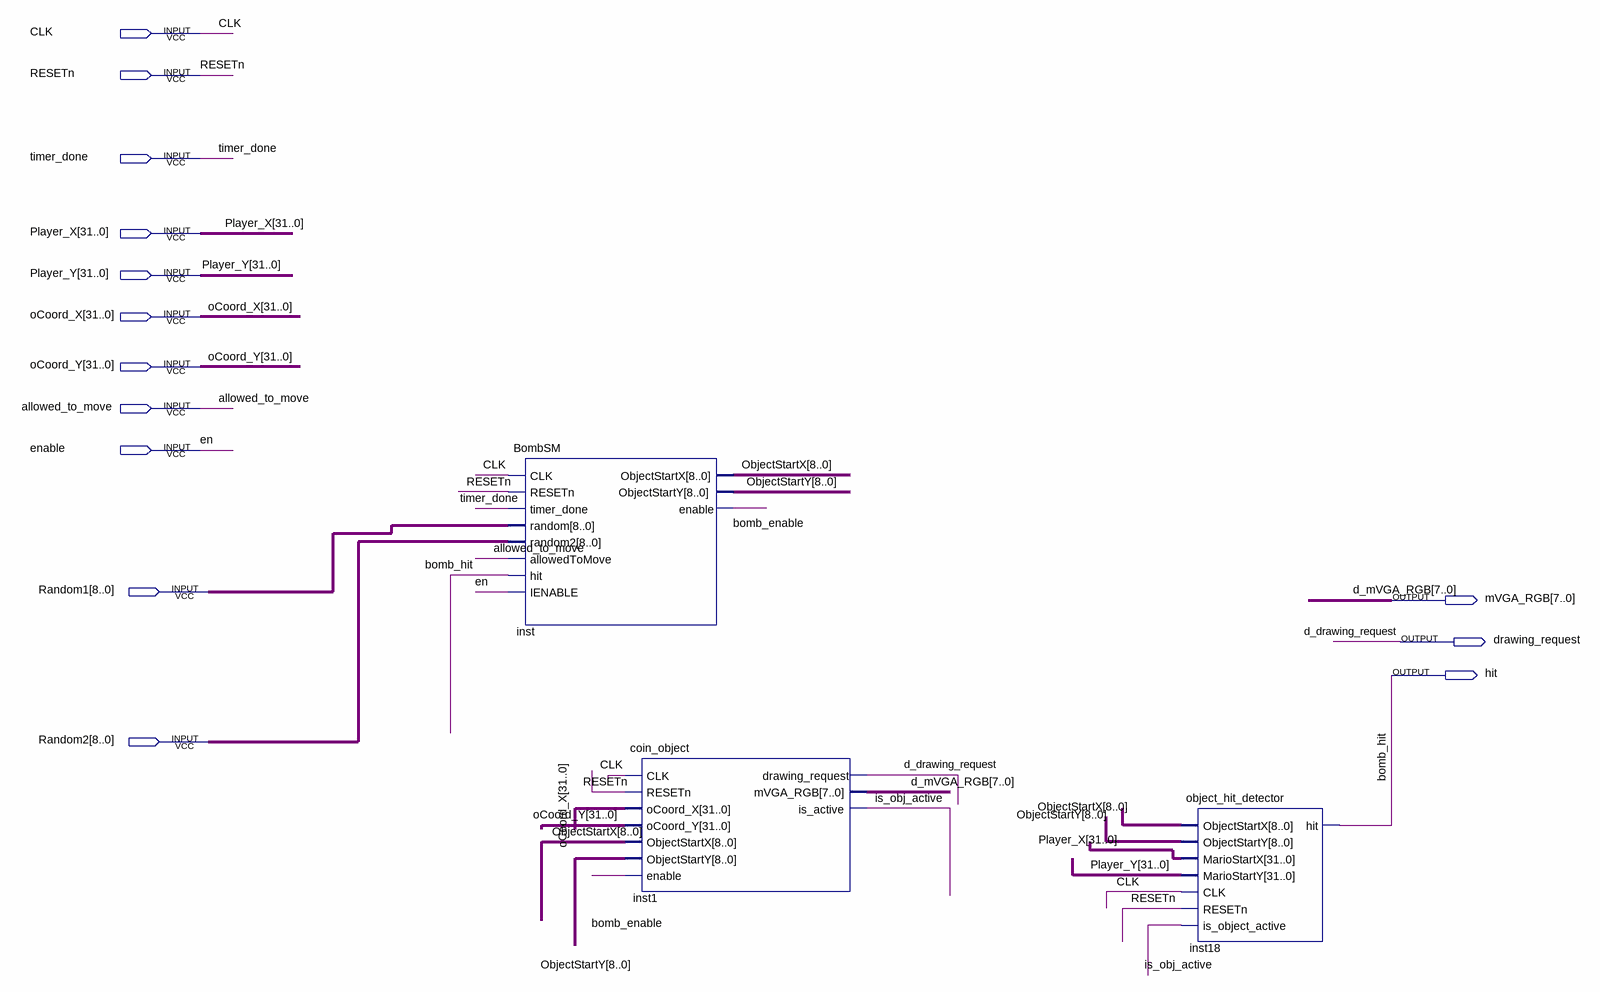
[diagram p0: schematic sheet]
// Quartus schematic GoldFull.bdf as structural Verilog: 3 symbols, 14 pins
module GoldFull (
  input  CLK,
  input  RESETn,
  input  timer_done,
  input  [31:0] Player_X,
  input  [31:0] Player_Y,
  input  [31:0] oCoord_X,
  input  [31:0] oCoord_Y,
  input  allowed_to_move,
  input  enable,
  input  [8:0] Random1,
  input  [8:0] Random2,
  output [7:0] mVGA_RGB,
  output drawing_request,
  output hit
);

  wire bomb_enable, is_obj_active;
  wire [8:0] ObjectStartX, ObjectStartY;

  BombSM inst (
    .CLK(CLK), .RESETn(RESETn), .timer_done(timer_done), .random(Random1), .random2(Random2),
    .allowedToMove(allowed_to_move), .hit(hit), .IENABLE(enable), .ObjectStartX(ObjectStartX),
    .ObjectStartY(ObjectStartY), .enable(bomb_enable));
  coin_object inst1 (
    .CLK(CLK), .RESETn(RESETn), .oCoord_X(oCoord_X), .oCoord_Y(oCoord_Y), .ObjectStartX(ObjectStartX),
    .ObjectStartY(ObjectStartY), .enable(bomb_enable), .drawing_request(drawing_request),
    .mVGA_RGB(mVGA_RGB), .is_active(is_obj_active));
  object_hit_detector inst18 (
    .ObjectStartX(ObjectStartX), .ObjectStartY(ObjectStartY), .MarioStartX(Player_X), .MarioStartY(Player_Y),
    .CLK(CLK), .RESETn(RESETn), .is_object_active(is_obj_active), .hit(hit));

  // Other names for the same wires on the sheet: bomb_hit = hit; d_drawing_request = drawing_request;
  //   d_mVGA_RGB[7:0] = mVGA_RGB; en = enable
endmodule
